# Altium schematic sheet Audio_Flash_EEProm.SchDoc: RapberryPi_Hat
size A4; Revision: V0.1; SheetNumber: X; SheetTotal: Y; Function: 数字功放，Flash，EEProm; number: 1; totle: 3
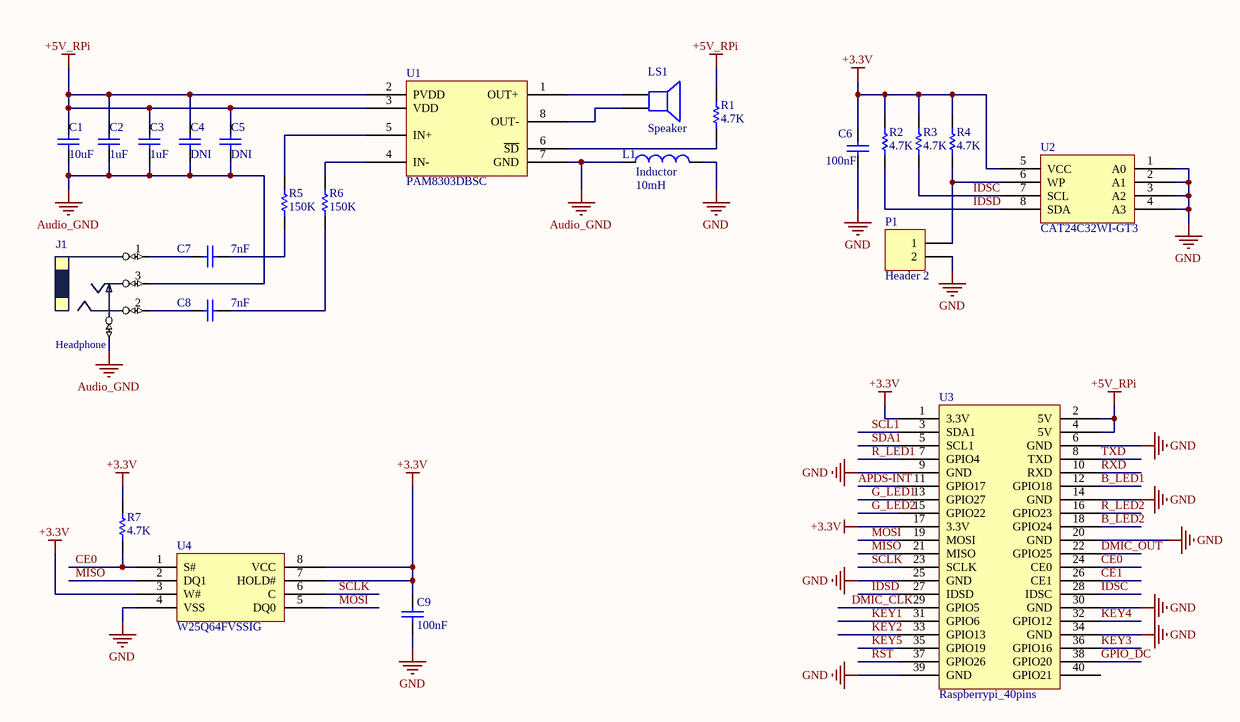
[diagram p0: Audio_Flash_EEProm.SchDoc]

## Parts
C1  10uF  [C0603]
C2  1uF  [C0603]
C3  1uF  [C0603]
C4  DNI  [C0603]
C5  DNI  [C0603]
C6  100nF  [C0603]
C7  7nF  [C0603]
C8  7nF  [C0603]
C9  100nF  [C0603]
J1  Headphone  [AudioJack]
L1  Inductor  value 10mH  [C0603]
LS1  Speaker  [Speaker]
P1  Header 2  [HDR1X2]
R1  4.7K  [R0603]
R2  4.7K  [R0603]
R3  4.7K  [R0603]
R4  4.7K  [R0603]
R5  150K  [R0603]
R6  150K  [R0603]
R7  4.7K  [R0603]
U1  PAM8303DBSC  [MSOP8]
U2  CAT24C32WI-GT3  [SOP-8]
U3  Raspberrypi_40pins  [SMT_2*20_2.54]
U4  W25Q64FVSSIG  [SOIC8]

## Nets
+3.3V: C6.2 C9.2 R2.2 R3.2 R4.2 R7.2 U2.5(VCC) U3.1(3.3V) U3.17(3.3V) U4.3(W#) U4.7(HOLD#) U4.8(VCC)
+5V_RPi: C1.2 C2.2 C3.2 C4.2 C5.2 R1.2 U1.2(PVDD) U1.3(VDD) U3.2(5V) U3.4(5V)
Audio_GND: C1.1 C2.1 C3.1 C4.1 C5.1 J1.3 J1.4 L1.1 U1.7(GND)
GND: C6.1 C9.1 L1.2 P1.2 U2.1(A0) U2.2(A1) U2.3(A2) U2.4(A3) U3.6(GND) U3.9(GND) U3.14(GND) U3.20(GND) U3.25(GND) U3.30(GND) U3.34(GND) U3.39(GND) U4.4(VSS)
APDS-INT: U3.11(GPIO17)
B_LED1: U3.12(GPIO18)
B_LED2: U3.18(GPIO24)
CE0: R7.1 U3.24(CE0) U4.1(S#)
CE1: U3.26(CE1)
DMIC_CLK: U3.29(GPIO5)
DMIC_OUT: U3.22(GPIO25)
G_LED1: U3.13(GPIO27)
G_LED2: U3.15(GPIO22)
GPIO_DC: U3.38(GPIO20)
IDSC: R3.1 U2.7(SCL) U3.28(IDSC)
IDSD: R2.1 U2.8(SDA) U3.27(IDSD)
KEY1: U3.31(GPIO6)
KEY2: U3.33(GPIO13)
KEY3: U3.36(GPIO16)
KEY4: U3.32(GPIO12)
KEY5: U3.35(GPIO19)
MISO: U3.21(MISO) U4.2(DQ1)
MOSI: U3.19(MOSI) U4.5(DQ0)
R_LED1: U3.7(GPIO4)
R_LED2: U3.16(GPIO23)
RST: U3.37(GPIO26)
RXD: U3.10(RXD)
SCL1: U3.3(SDA1)
SCLK: U3.23(SCLK) U4.6(C)
SDA1: U3.5(SCL1)
TXD: U3.8(TXD)
NetC7_1: C7.1 R5.2
NetC7_2: C7.2 J1.1(L)
NetC8_1: C8.1 R6.2
NetC8_2: C8.2 J1.2(R)
NetLS1_1: LS1.1 U1.1(OUT+)
NetLS1_2: LS1.2 U1.8(OUT-)
NetP1_1: P1.1 R4.1 U2.6(WP)
NetR1_1: R1.1 U1.6(~{SD})
NetR5_1: R5.1 U1.5(IN+)
NetR6_1: R6.1 U1.4(IN-)

Not connected (* = marked no-connect by the designer): U3 40(GPIO21)

## Notes on the sheet
- 工程名称：
- 图纸大小：
- 日期：
- A4
- 版本号：
- 页码：
- 第
- 共
- 制图：
- 审核：

## Library data of the parts
C1-C8 = Cap Semi: Capacitor (Semiconductor SIM Model); Published: 8-Jun-2000; LatestRevisionDate: 29-May-2009; LatestRevisionNote: IPC-7351 Footprint Added.; PackageReference: C1206; Publisher: Altium Limited; PackageDescription: Chip Capacitor
  C1: Value: 10uF
  C2 C3: Value: 1uF
  C4 C5: Value: DNI
  C6: Value: 100nF
  C7 C8: Value: 7nF
C9 = Cap: Capacitor; Value: 100nF 封装0402 精度20% 耐压值6.3V以上; Published: 8-Jun-2000; LatestRevisionDate: 17-Jul-2002; LatestRevisionNote: Re-released for DXP Platform.; PackageReference: RAD-0.3; Publisher: Altium Limited; PackageDescription: Radial Cap, Thru-Hole; 2 Leads; 0.3 in Pin Spacing
J1 = PHONEJACK1
L1 = Inductor: Code_IEC: 1005; Published: 8-Jun-2000; LatestRevisionDate: 29-May-2009; LatestRevisionNote: IPC-7351 Footprint Added.; PackageReference: 0402-A; Publisher: Altium Limited; PackageDescription: Chip Inductor; Code_JEITA: 0402
LS1 = Speaker: Loudspeaker; Published: 24-Mar-1999; LatestRevisionDate: 17-Jul-2002; LatestRevisionNote: Re-released for DXP Platform.; PackageReference: PIN2; Publisher: Altium Limited
P1 = Header 2: Header, 2-Pin; LatestRevisionDate: 17-Jul-2002; LatestRevisionNote: Re-released for DXP Platform.; Publisher: Altium Limited
R1-R6 = Res1: Resistor; Published: 8-Jun-2000; LatestRevisionDate: 17-Jul-2002; LatestRevisionNote: Re-released for DXP Platform.; PackageReference: AXIAL-0.3; Publisher: Altium Limited; PackageDescription: Axial Device, Thru-Hole; 2 Leads; 0.3 in Pin Spacing
  R1-R4: Value: 4.7K
  R5 R6: Value: 150K
R7 = Res1: Resistor; Value: 10K 封装0402  精度5%; Published: 8-Jun-2000; LatestRevisionDate: 17-Jul-2002; LatestRevisionNote: Re-released for DXP Platform.; PackageReference: AXIAL-0.3; Publisher: Altium Limited; PackageDescription: Axial Device, Thru-Hole; 2 Leads; 0.3 in Pin Spacing
U1 = PAM8303D
U2 = CAT24C32WI-GT3: Raspiberry Config EEProm
U3 = Raspberrypi_40pins: 树莓派40pin管脚
U4 = M25P32-VMW6TG: Value: W25Q64FVSSIG